# Altium project 四轴.PrjPCB
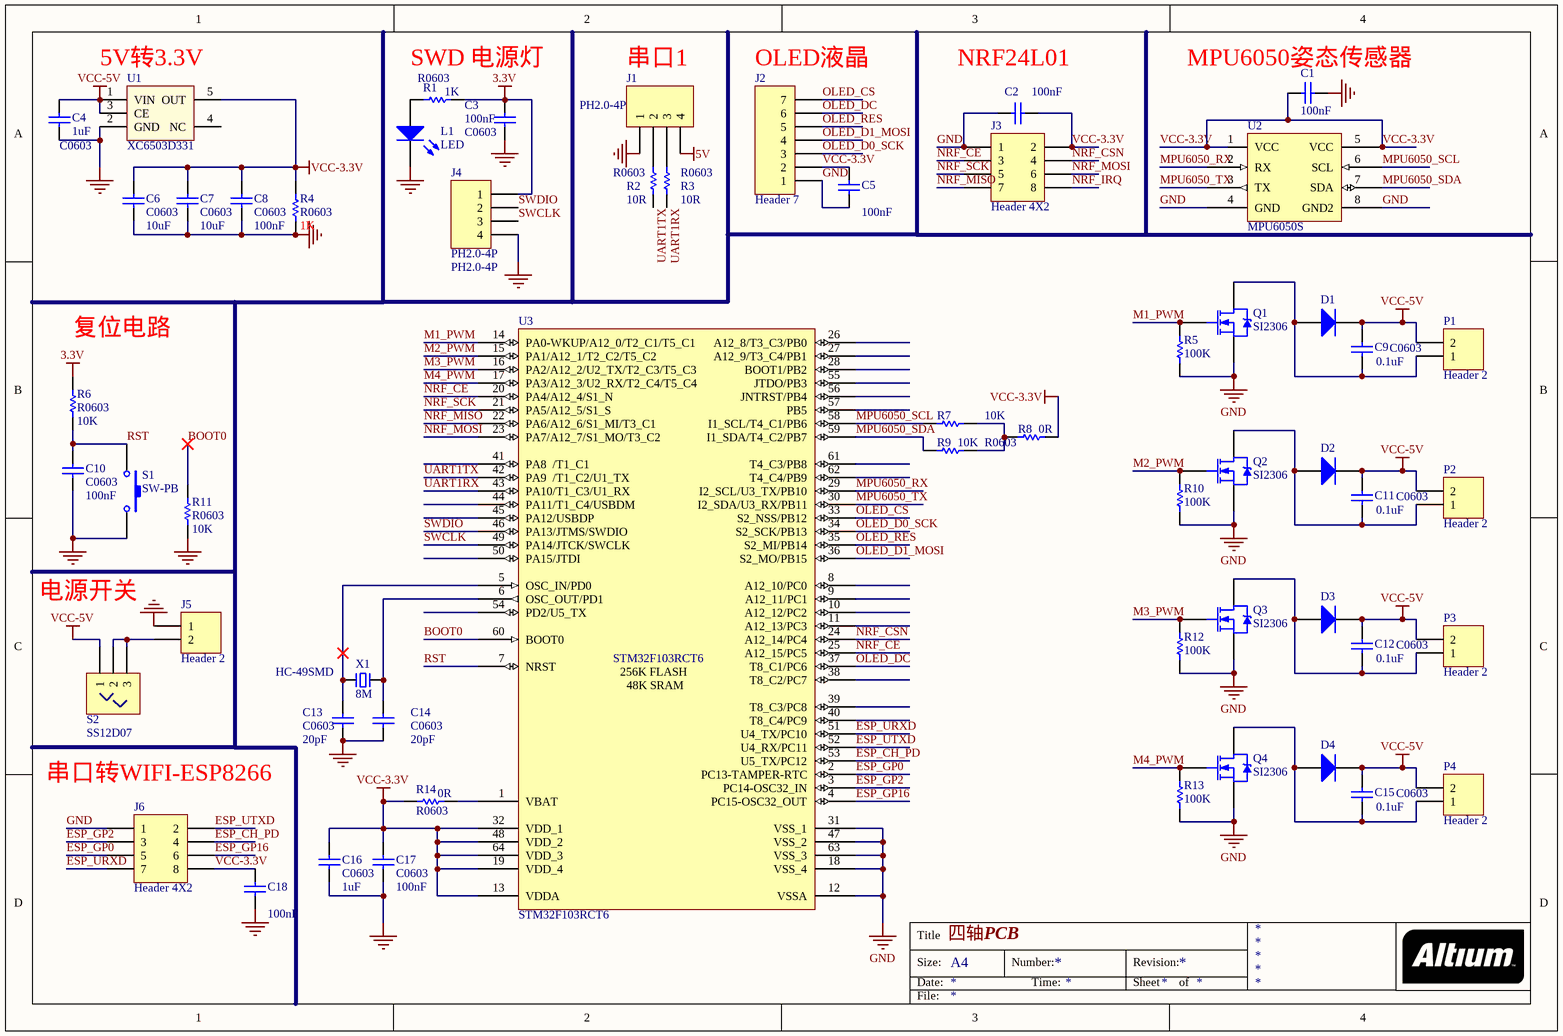
[diagram p0: 四轴.SchDoc]
1 sheet, 57 parts. Net scope: global (net labels, ports and power ports of the same name join across sheets).

## Sheet 四轴.SchDoc: 四轴PCB
size A4

### Parts
C1  value 100nF  [0603]  (hidden comment: C0603)
C2  value 100nF  [0603]  (hidden comment: C0603)
C3  C0603  value 100nF  [0603]
C4  C0603  value 1uF  [0603]
C5  value 100nF  [0603]  (hidden comment: C0603)
C6  C0603  value 10uF  [0603]
C7  C0603  value 10uF  [0603]
C8  C0603  value 100nF  [0603]
C9  C0603  value 0.1uF  [0603]
C10  C0603  value 100nF  [0603]
C11  C0603  value 0.1uF  [0603]
C12  C0603  value 0.1uF  [0603]
C13  C0603  value 20pF  [0603]
C14  C0603  value 20pF  [0603]
C15  C0603  value 0.1uF  [0603]
C16  C0603  value 1uF  [0603]
C17  C0603  value 100nF  [0603]
C18  value 100nF  [0603]  (hidden comment: C0603)
D1  SS14  [SMA]  (value not drawn)
D2  SS14  [SMA]  (value not drawn)
D3  SS14  [SMA]  (value not drawn)
D4  SS14  [SMA]  (value not drawn)
J1  PH2.0-4P  [PH2.0-4P]
J2  Header 7  [HDR1X7]
J3  Header 4X2  [HDR2X4]
J4  PH2.0-4P  [PH2.0-4P]
J5  Header 2  [XH2.54-2]
J6  Header 4X2  [HDR2X4]
L1  LED  [0603]
P1  Header 2  [HDR1X2]
P2  Header 2  [HDR1X2]
P3  Header 2  [HDR1X2]
P4  Header 2  [HDR1X2]
Q1  SI2306  [SOT-23_L]
Q2  SI2306  [SOT-23_L]
Q3  SI2306  [SOT-23_L]
Q4  SI2306  [SOT-23_L]
R1  R0603  value 1K  [0603]
R2  R0603  value 10R  [0603]
R3  R0603  value 10R  [0603]
R4  R0603  value 1K  [0603]
R5  value 100K  [0603]  (hidden comment: Res1)
R6  R0603  value 10K  [0603]
R7  10K  [0603]
R8  0R  [0603]
R9  R0603  value 10K  [0603]
R10  value 100K  [0603]  (hidden comment: Res1)
R11  R0603  value 10K  [0603]
R12  value 100K  [0603]  (hidden comment: Res1)
R13  value 100K  [0603]  (hidden comment: Res1)
R14  R0603  value 0R  [0603]
S1  SW-PB  [SPST-2]
S2  SS12D07  [SS-12D07]
U1  XC6503D331  [SOT23-5]
U2  MPU6050S  [MPU6050S]
U3  STM32F103RCT6  [LQFP64_N]
X1  8M  value HC-49SMD  [HC-49SMD]

### Nets
3.3V: C3.1 J4.1 R1.2 R6.1
5V: J1.4
GND: C1.2 C2.2 C3.2 C4.1 C5.2 C6.2 C7.1 C8.1 C10.2 C13.1 C14.1 C16.1 C17.1 C18.2 J1.1 J2.1 J3.1 J4.4 J5.1 J6.1 L1.2(K) Q1.2(S) Q2.2(S) Q3.2(S) Q4.2(S) R4.1 R5.1 R10.1 R11.2 R12.1 R13.1 S1.2 U1.2(GND) U2.4(GND) U2.8(GND2) U3.12(VSSA) U3.18(VSS_4) U3.31(VSS_1) U3.47(VSS_2) U3.63(VSS_3)
VCC-3.3V: C1.1 C2.1 C5.1 C6.1 C7.2 C8.2 C16.2 C17.2 C18.1 J2.2 J3.2 J6.8 R4.2 R8.1 R14.1 U1.5(OUT) U2.1(VCC) U2.5(VCC) U3.13(VDDA) U3.19(VDD_4) U3.32(VDD_1) U3.48(VDD_2) U3.64(VDD_3)
VCC-5V: C4.2 C9.2 C11.2 C12.2 C15.2 D1.2(K) D2.2(K) D3.2(K) D4.2(K) P1.2 P2.2 P3.2 P4.2 S2.1 U1.1(VIN) U1.3(CE)
BOOT0: R11.1 U3.60(BOOT0)
ESP_CH_PD: J6.4 U3.53(U5_TX/PC12)
ESP_GP0: J6.5 U3.2(PC13-TAMPER-RTC)
ESP_GP2: J6.3 U3.3(PC14-OSC32_IN)
ESP_GP16: J6.6 U3.4(PC15-OSC32_OUT)
ESP_URXD: J6.7 U3.51(U4_TX/PC10)
ESP_UTXD: J6.2 U3.52(U4_RX/PC11)
M1_PWM: Q1.1(G) R5.2 U3.14(PA0-WKUP/A12_0/T2_C1/T5_C1)
M2_PWM: Q2.1(G) R10.2 U3.15(PA1/A12_1/T2_C2/T5_C2)
M3_PWM: Q3.1(G) R12.2 U3.16(PA2/A12_2/U2_TX/T2_C3/T5_C3)
M4_PWM: Q4.1(G) R13.2 U3.17(PA3/A12_3/U2_RX/T2_C4/T5_C4)
MPU6050_RX: U2.2(RX) U3.29(I2_SCL/U3_TX/PB10)
MPU6050_SCL: R7.1 U2.6(SCL) U3.58(I1_SCL/T4_C1/PB6)
MPU6050_SDA: R9.1 U2.7(SDA) U3.59(I1_SDA/T4_C2/PB7)
MPU6050_TX: U2.3(TX) U3.30(I2_SDA/U3_RX/PB11)
NRF_CE: J3.3 U3.20(PA4/A12_4/S1_N) U3.25(A12_15/PC5)
NRF_CSN: J3.4 U3.24(A12_14/PC4)
NRF_IRQ: J3.8
NRF_MISO: J3.7 U3.22(PA6/A12_6/S1_MI/T3_C1)
NRF_MOSI: J3.6 U3.23(PA7/A12_7/S1_MO/T3_C2)
NRF_SCK: J3.5 U3.21(PA5/A12_5/S1_S)
OLED_CS: J2.7 U3.33(S2_NSS/PB12)
OLED_D0_SCK: J2.3 U3.34(S2_SCK/PB13)
OLED_D1_MOSI: J2.4 U3.36(S2_MO/PB15)
OLED_DC: J2.6 U3.37(T8_C1/PC6)
OLED_RES: J2.5 U3.35(S2_MI/PB14)
RST: C10.1 R6.2 S1.1 U3.7(NRST)
SWCLK: J4.3 U3.49(PA14/JTCK/SWCLK)
SWDIO: J4.2 U3.46(PA13/JTMS/SWDIO)
UART1RX: R3.2 U3.43(PA10/T1_C3/U1_RX)
UART1TX: R2.2 U3.42(PA9__/T1_C2/U1_TX)
NetC9_1: C9.1 D1.1(A) P1.1 Q1.3(D)
NetC11_1: C11.1 D2.1(A) P2.1 Q2.3(D)
NetC12_1: C12.1 D3.1(A) P3.1 Q3.3(D)
NetC13_2: C13.2 U3.5(OSC_IN/PD0) X1.2
NetC14_2: C14.2 U3.6(OSC_OUT/PD1) X1.1
NetC15_1: C15.1 D4.1(A) P4.1 Q4.3(D)
NetJ1_2: J1.2 R2.1
NetJ1_3: J1.3 R3.1
NetJ5_2: J5.2 S2.2 S2.3
NetL1_1: L1.1(A) R1.1
NetR7_2: R7.2 R8.2 R9.2
NetR14_2: R14.2 U3.1(VBAT)

Not connected (* = marked no-connect by the designer): U1 4(NC); U3 8(A12_10/PC0) 9(A12_11/PC1) 10(A12_12/PC2) 11(A12_13/PC3) 26(A12_8/T3_C3/PB0) 27(A12_9/T3_C4/PB1) 28(BOOT1/PB2) 38(T8_C2/PC7) 39(T8_C3/PC8) 40(T8_C4/PC9) 41(PA8__/T1_C1) 44(PA11/T1_C4/USBDM) 45(PA12/USBDP) 50(PA15/JTDI) 54(PD2/U5_TX) 55(JTDO/PB3) 56(JNTRST/PB4) 57(PB5) 61(T4_C3/PB8) 62(T4_C4/PB9)

### Notes on the sheet
- (near U1) 5V转3.3V
- SWD 电源灯
- 串口1
- (near J2) OLED液晶
- (near C2) NRF24L01
- (near C1) MPU6050姿态传感器
- (near R6) 复位电路
- 电源开关
- (near J6) 串口转WIFI-ESP8266
- Title
- Size:
- Date:
- A4
- Number:
- Time:
- Revision:
- Sheet
- of
- File:
- (in symbol STM32F103RCT6) 256K FLASH; 48K SRAM

### Library data of the parts
C1-C18 = Cap: Capacitor; Published: 8-Jun-2000; LatestRevisionDate: 17-Jul-2002; LatestRevisionNote: Re-released for DXP Platform.; PackageReference: RAD-0.3; Publisher: Altium Limited; PackageDescription: Radial Cap, Thru-Hole; 2 Leads; 0.3 in Pin Spacing
D1-D4 = SS14: 28V 1A; Published: 8-Jun-2000; LatestRevisionDate: 17-Jul-2002; LatestRevisionNote: Re-released for DXP Platform.; PackageVersion: Sep-1996; PackageReference: SMC; Publisher: Altium Limited; PackageDescription: DO-214-AB/SMC; 2 C-Bend Leads; Body 7.9 x 5.9 mm, inc. leads (LxW); Code_JEDEC: DO-214-AB
J1 J4 = Header 4: Header, 4-Pin; LatestRevisionDate: 17-Jul-2002; LatestRevisionNote: Re-released for DXP Platform.; Publisher: Altium Limited; Value: PH2.0-4P
J2 = Header 7: Header, 7-Pin; LatestRevisionDate: 17-Jul-2002; LatestRevisionNote: Re-released for DXP Platform.; Publisher: Altium Limited
J3 J6 = Header 4X2: Header, 4-Pin, Dual row; LatestRevisionDate: 17-Jul-2002; LatestRevisionNote: Re-released for DXP Platform.; Publisher: Altium Limited
J5 P1-P4 = Header 2: Header, 2-Pin; LatestRevisionDate: 17-Jul-2002; LatestRevisionNote: Re-released for DXP Platform.; Publisher: Altium Limited
Q1-Q4 = MOS-N: N-Channel MOSFET; Published: 8-Jun-2000; LatestRevisionDate: 17-Jul-2002; LatestRevisionNote: Re-released for DXP Platform.; PackageVersion: 1995/1996; PackageReference: E3; Publisher: Altium Limited; PackageDescription: TO, Flat Index; 3 In-Line, Axial Leads; Body Dia. 4.6mm; Lead Dia. 0.5 mm (max); Value: *
R1-R14 = Res1: Resistor; Published: 8-Jun-2000; LatestRevisionDate: 17-Jul-2002; LatestRevisionNote: Re-released for DXP Platform.; PackageReference: AXIAL-0.3; Publisher: Altium Limited; PackageDescription: Axial Device, Thru-Hole; 2 Leads; 0.3 in Pin Spacing
  R7: Value: 10K
  R8: Value: 0R
S1 = SW-PB: Switch; Published: 24-Mar-1999; LatestRevisionDate: 17-Jul-2002; LatestRevisionNote: Re-released for DXP Platform.; PackageReference: SPST-2; Publisher: Altium Limited; PackageDescription: Switch; 2 Leads
U1 = XC6503Dxxx: Value: XC6503D331
X1 = XTAL
S2 = SS12D07: Value: SS12D07
U3 = STM32F103RCT6: Published: 30-May-2008; DatasheetVersion: rev6, Mar-2008; PackageVersion: Mar-2008; PackageReference: LQFP64; Publisher: Altium Limited; PackageDescription: 64-Pin Low-Profile Quad Flat Pack, 10 x 10 mm Body, 0.5 mm Pitch (LQFP64); ComponentLink1Description: Manufacturer Link; ComponentLink1URL: www.st.com/stm32; ComponentLink2Description: Datasheet; ComponentLink2URL: http://www.st.com/stonline/products/literature/ds/13587.pdf